# Altium schematic sheet WiirdFlex Bottom.SchDoc
size A; SheetNumber: 1; SheetTotal: 7
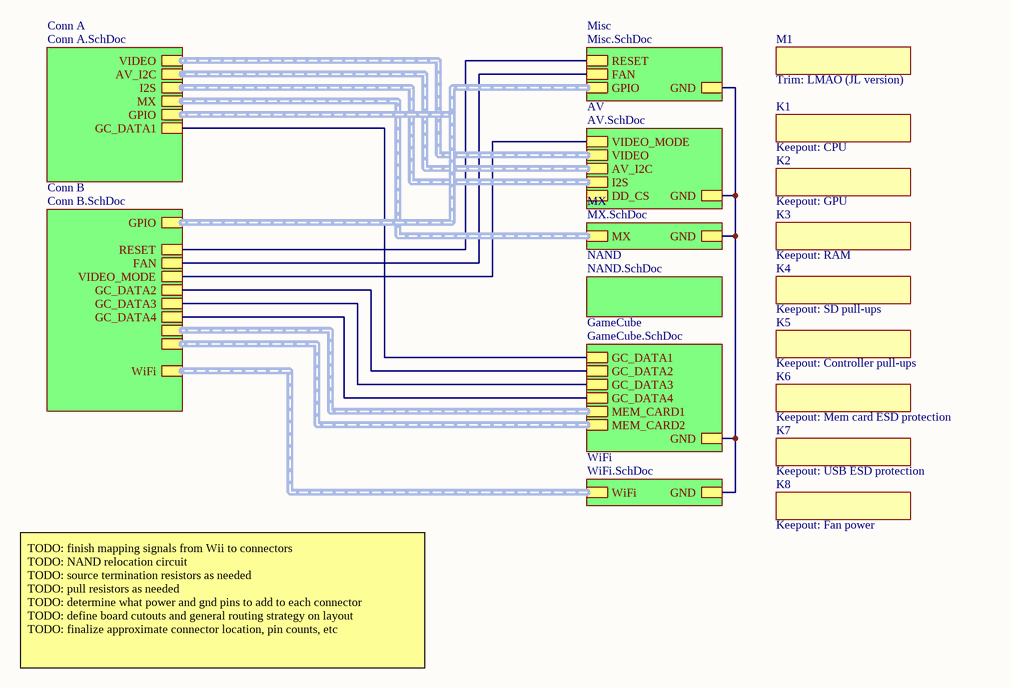
[diagram p0: WiirdFlex Bottom.SchDoc]

## Parts
K1  Keepout: CPU  [RVK-1_Bottom_Keepout_CPU]
K2  Keepout: GPU  [RVK-1_Bottom_Keepout_GPU]
K3  Keepout: RAM  [RVK-1_Bottom_Keepout_RAM]
K4  Keepout: SD pull-ups  [RVK-1_Bottom_Keepout_SD_Pullups]
K5  Keepout: Controller pull-ups  [RVK-1_Bottom_Keepout_Controller_Pullups]
K6  Keepout: Mem card ESD protection  [RVK-1_Bottom_Keepout_MemCard_ESD]
K7  Keepout: USB ESD protection  [RVK-1_Bottom_Keepout_USB_ESD]
K8  Keepout: Fan power  [RVK-1_Bottom_Keepout_Fan_Power]
M1  Trim: LMAO (JL version)  [Wii Trim: LMAO with extra mounting hole]

## Sub-sheets
AV = AV.SchDoc: VIDEO_MODE, GND, VIDEO (harness VIDEO), AV_I2C (harness I2C), I2S (harness I2S), DD_CS
Conn A = Conn A.SchDoc: VIDEO, AV_I2C, I2S, MX, GPIO, GC_DATA1
Conn B = Conn B.SchDoc: GPIO, RESET, FAN, VIDEO_MODE, GC_DATA2, GC_DATA3, GC_DATA4, , , WiFi
GameCube = GameCube.SchDoc: MEM_CARD1 (harness MEM_CARD), MEM_CARD2 (harness MEM_CARD), GC_DATA4, GND, GC_DATA1, GC_DATA3, GC_DATA2
Misc = Misc.SchDoc: GND, GPIO (harness GPIO), RESET, FAN
MX = MX.SchDoc: MX (harness MX), GND
NAND = NAND.SchDoc: no entries
WiFi = WiFi.SchDoc: WiFi (harness WiFi), GND

## Nets
(unnamed): sheet Misc/GND, sheet AV/GND, sheet MX/GND, sheet WiFi/GND, sheet GameCube/GND
(unnamed): sheet Misc/RESET, sheet Conn B/RESET
(unnamed): sheet Misc/FAN, sheet Conn B/FAN
(unnamed): sheet AV/VIDEO_MODE, sheet Conn B/VIDEO_MODE
(unnamed): sheet GameCube/GC_DATA4, sheet Conn B/GC_DATA4
(unnamed): sheet GameCube/GC_DATA1, sheet Conn A/GC_DATA1
(unnamed): sheet GameCube/GC_DATA3, sheet Conn B/GC_DATA3
(unnamed): sheet GameCube/GC_DATA2, sheet Conn B/GC_DATA2

## Buses and harness runs
harness sheet AV/AV_I2C = sheet Conn A/AV_I2C
harness sheet AV/I2S = sheet Conn A/I2S
harness sheet AV/VIDEO = sheet Conn A/VIDEO
harness sheet Conn A/GPIO = sheet Conn B/GPIO = sheet Misc/GPIO
harness sheet Conn A/MX = sheet MX/MX
harness sheet Conn B/ = sheet GameCube/MEM_CARD1
harness sheet Conn B/ = sheet GameCube/MEM_CARD2
harness sheet Conn B/WiFi = sheet WiFi/WiFi

## Notes on the sheet
- TODO: finish mapping signals from Wii to connectors
  TODO: NAND relocation circuit
  TODO: source termination resistors as needed
  TODO: pull resistors as needed
  TODO: determine what power and gnd pins to add to each connector
  TODO: define board cutouts and general routing strategy on layout
  TODO: finalize approximate connector location, pin counts, etc

## Library data of the parts
K1-K8 M1 = Misc: placeholder for footprints without pads - keepouts, trim outlines, etc; ClassName: Keepout